# EAGLE schematic mainboard (EAGLE 6.4)
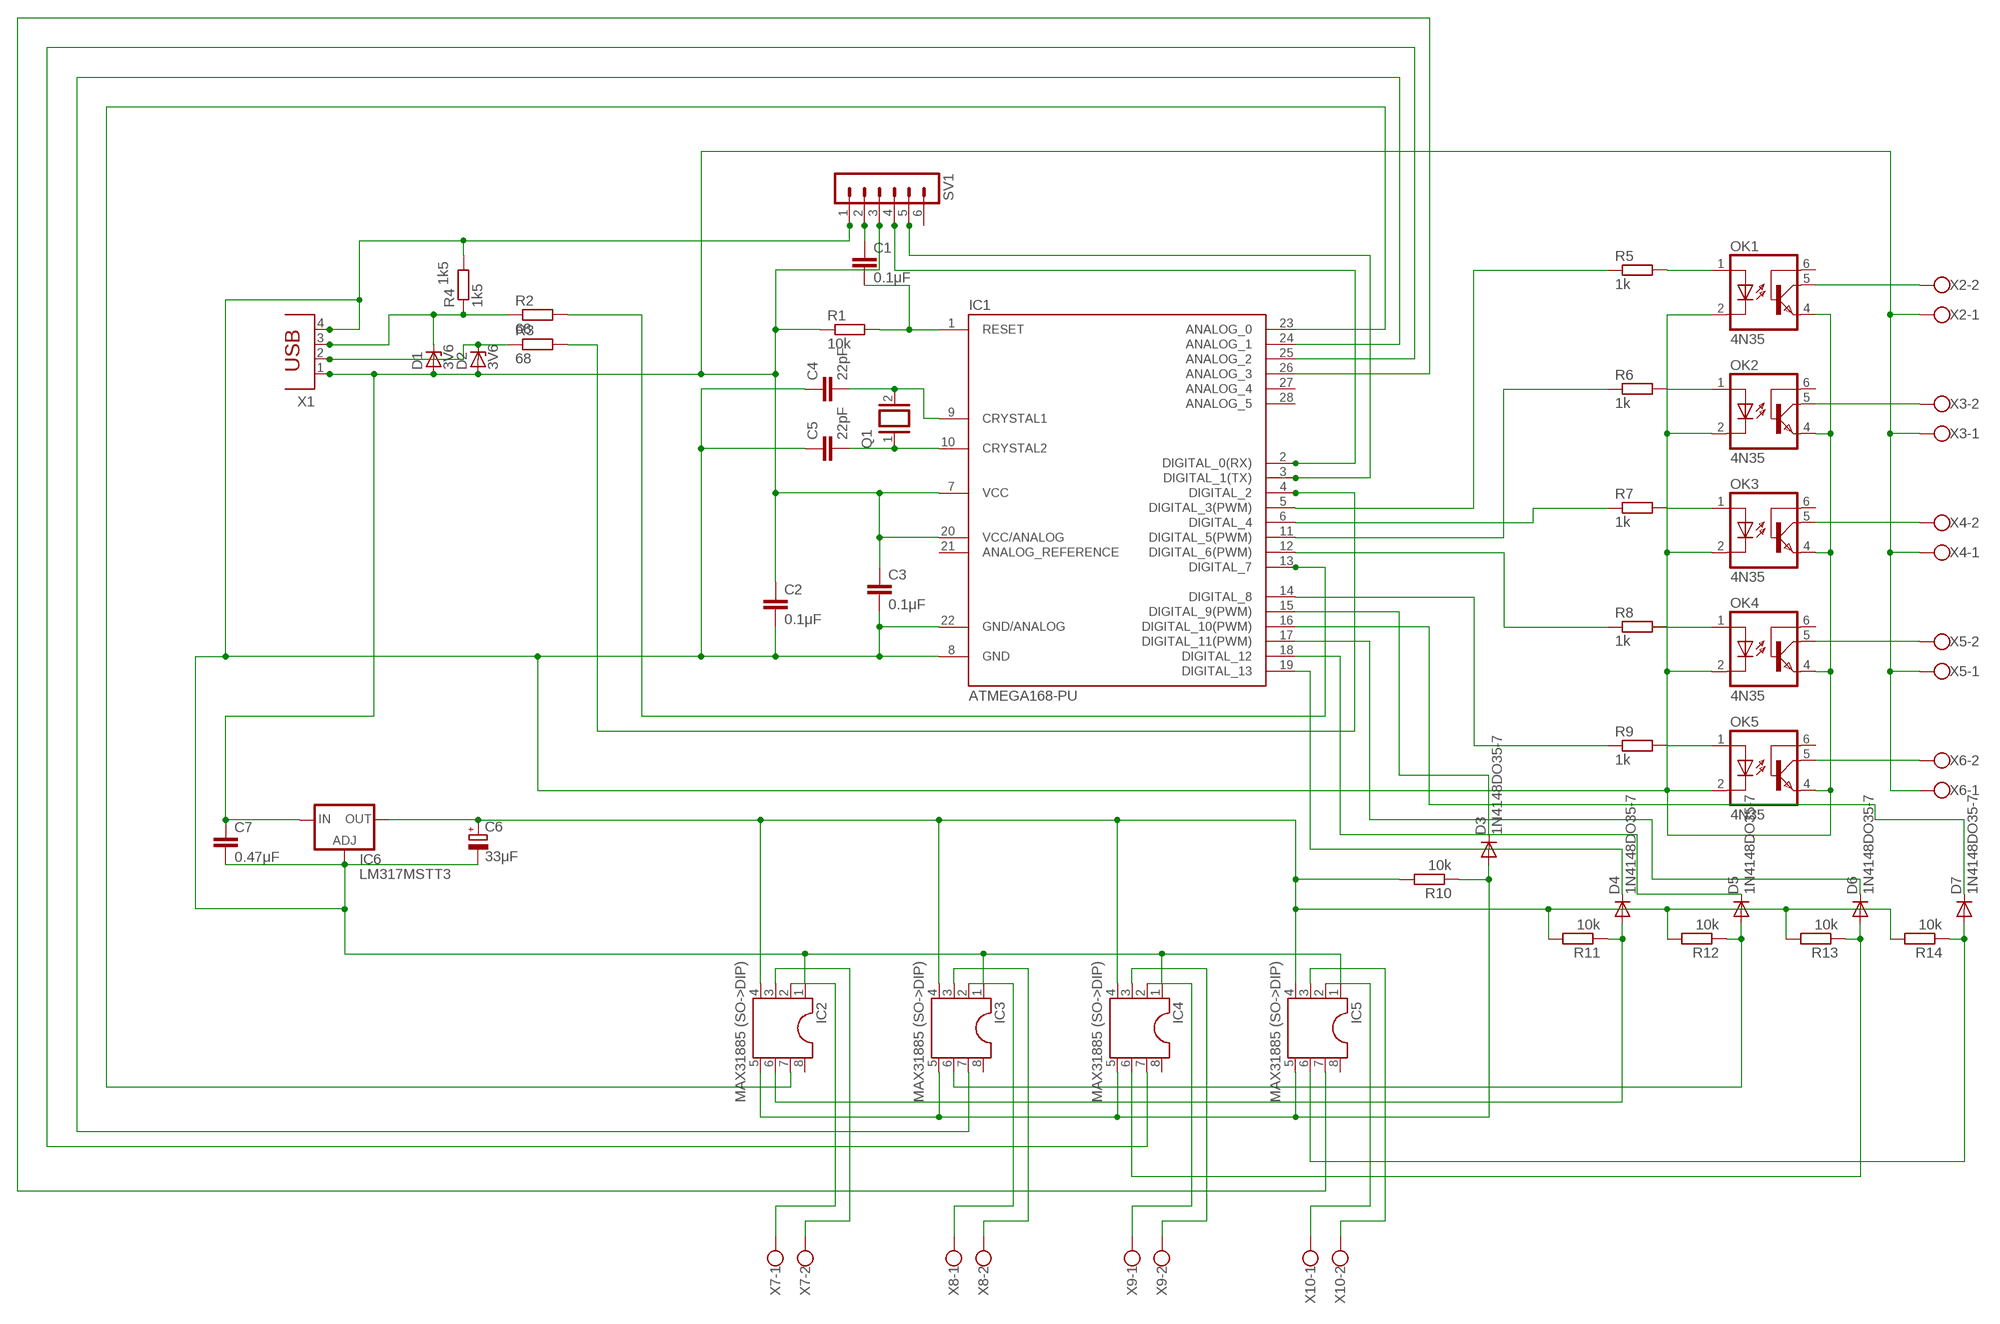
[diagram p0: schematic, sheet 1]

## Parts
C1  0.1μF  C2,5-3  [C2.5-3]
C2  0.1μF  C2,5-3  [C2.5-3]
C3  0.1μF  C2,5-3  [C2.5-3]
C4  22pF  C2,5-3  [C2.5-3]
C5  22pF  C2,5-3  [C2.5-3]
C6  33μF  CPOL-EU153CLV-0605  [153CLV-0605]
C7  0.47μF  C2,5-3  [C2.5-3]
D1  3V6  ZENER-DIODEZD-5  [ZDIO-5]
D2  3V6  ZENER-DIODEZD-5  [ZDIO-5]
D3  1N4148DO35-7  [DO35-7]
D4  1N4148DO35-7  [DO35-7]
D5  1N4148DO35-7  [DO35-7]
D6  1N4148DO35-7  [DO35-7]
D7  1N4148DO35-7  [DO35-7]
IC1  ATMEGA168-PU  [DIL28-3]
IC2  DIL8S  [SOCKET-08]
IC3  DIL8S  [SOCKET-08]
IC4  DIL8S  [SOCKET-08]
IC5  DIL8S  [SOCKET-08]
IC6  LM317MSTT3  [SOT223]
OK1  4N35  [DIL06]
OK2  4N35  [DIL06]
OK3  4N35  [DIL06]
OK4  4N35  [DIL06]
OK5  4N35  [DIL06]
Q1  XTAL/S  [QS]
R1  10k  R-EU_0204/7  [0204/7]
R2  68  R-EU_0204/7  [0204/7]
R3  68  R-EU_0204/7  [0204/7]
R4  1k5  R-EU_0204/7  [0204/7]
R5  1k  R-EU_0204/7  [0204/7]
R6  1k  R-EU_0204/7  [0204/7]
R7  1k  R-EU_0204/7  [0204/7]
R8  1k  R-EU_0204/7  [0204/7]
R9  1k  R-EU_0204/7  [0204/7]
R10  10k  R-EU_0204/7  [0204/7]
R11  10k  R-EU_0204/7  [0204/7]
R12  10k  R-EU_0204/7  [0204/7]
R13  10k  R-EU_0204/7  [0204/7]
R14  10k  R-EU_0204/7  [0204/7]
SV1  MA06-1  [MA06-1]
X1  PN61729  [PN61729]
X2  W237-102  [W237-102]
X3  W237-102  [W237-102]
X4  W237-102  [W237-102]
X5  W237-102  [W237-102]
X6  W237-102  [W237-102]
X7  W237-102  [W237-102]
X8  W237-102  [W237-102]
X9  W237-102  [W237-102]
X10  W237-102  [W237-102]

## Nets
N$1: C1.2 IC1.1(RESET) R1.2
N$2: D1.C R2.1 R4.1 X1.3
N$3: C2.1 C3.1 C7.1 D1.A D2.A IC1.7(VCC) IC1.20(VCC/ANALOG) IC6.3(IN) R1.1 SV1.3 X1.1 X2.1 X3.1 X4.1 X5.1 X6.1
N$4: C1.1 SV1.2
N$5: D2.C R3.1 X1.2
N$6: IC1.2(DIGITAL_0(RX)) SV1.4
N$7: IC1.3(DIGITAL_1(TX)) SV1.5
N$8: C4.2 IC1.9(CRYSTAL1) Q1.2
N$9: IC2.3 X7.2
N$10: IC1.4(DIGITAL_2) R3.2
N$11: IC1.13(DIGITAL_7) R2.2
N$12: C5.2 IC1.10(CRYSTAL2) Q1.1
N$13: IC1.5(DIGITAL_3(PWM)) R5.1
N$14: IC1.11(DIGITAL_5(PWM)) R6.1
N$15: IC1.6(DIGITAL_4) R7.1
N$16: IC1.12(DIGITAL_6(PWM)) R8.1
N$17: IC1.14(DIGITAL_8) R9.1
N$18: OK1.1(A) R5.2
N$19: OK2.1(A) R6.2
N$20: OK3.1(A) R7.2
N$21: OK4.1(A) R8.2
N$22: OK5.1(A) R9.2
N$23: OK5.5(COL) X6.2
N$24: OK4.5(COL) X5.2
N$25: OK3.5(COL) X4.2
N$26: OK2.5(COL) X3.2
N$27: OK1.5(COL) X2.2
N$28: IC2.2 X7.1
N$29: C2.2 C3.2 C4.1 C5.1 C6.- C7.2 IC1.8(GND) IC1.22(GND/ANALOG) IC2.1 IC3.1 IC4.1 IC5.1 IC6.1(ADJ) OK1.2(C) OK1.4(EMI) OK2.2(C) OK2.4(EMI) OK3.2(C) OK3.4(EMI) OK4.2(C) OK4.4(EMI) OK5.2(C) OK5.4(EMI) R4.2 SV1.1 X1.4
N$30: C6.+ IC2.4 IC3.4 IC4.4 IC5.4 IC6.4(OUT) R10.2 R11.2 R12.2 R13.2 R14.2
N$31: IC3.3 X8.2
N$32: IC4.3 X9.2
N$33: IC5.3 X10.2
N$34: IC3.2 X8.1
N$35: IC4.2 X9.1
N$36: IC5.2 X10.1
N$37: D3.A IC2.5 IC3.5 IC4.5 IC5.5 R10.1
N$38: D3.C IC1.15(DIGITAL_9(PWM))
N$39: D5.A IC3.6 R12.1
N$40: D4.A IC2.6 R11.1
N$41: D6.A IC4.6 R13.1
N$42: D7.A IC5.6 R14.1
N$43: D4.C IC1.19(DIGITAL_13)
N$44: D5.C IC1.18(DIGITAL_12)
N$45: D6.C IC1.17(DIGITAL_11(PWM))
N$46: D7.C IC1.16(DIGITAL_10(PWM))
N$47: IC1.23(ANALOG_0) IC2.7
N$48: IC1.24(ANALOG_1) IC3.7
N$49: IC1.25(ANALOG_2) IC4.7
N$50: IC1.26(ANALOG_3) IC5.7
Unconnected: IC1.21(ANALOG_REFERENCE) IC1.27(ANALOG_4) IC1.28(ANALOG_5) IC2.8 IC3.8 IC4.8 IC5.8 OK1.6(BAS) OK2.6(BAS) OK3.6(BAS) OK4.6(BAS) OK5.6(BAS) SV1.6

## Notes on the sheet
- 1k5
- MAX31885 (SO->DIP) | MAX31885 (SO->DIP) | MAX31885 (SO->DIP) | MAX31885 (SO->DIP)

## Library data of the parts
C1-C5 C7 = capacitor-wima:C: CAPACITOR naming: grid - package width
C6 = resistor:CPOL-EU: POLARIZED CAPACITOR, European symbol
D1 D2 = diode:ZENER-DIODE: Z-Diode
D3-D7 = diode:1N4148: DIODE high speed (Philips)
IC1 = Arduino-AVR:ATMEGA168-PU
IC2-IC5 = ic-package:DIL8: Dual In Line / Socket
IC6 = v-reg-mod:LM317?*: 500 mA Adjustable Output Positive Voltage Regulator Source: http://www.onsemi.co.jp .. LM317M-D.PDF
OK1-OK5 = optocoupler:4N35: MOTOROLA OPTO COUPLER; MF: FAIRCHILD SEMICONDUCTOR; MPN: 4N35; OC_FARNELL: 1328375; OC_NEWARK: 72K9946
Q1 = special:XTAL/S: CRYSTAL
R1-R14 = resistor:R-EU_: RESISTOR, European symbol
SV1 = con-lstb:MA06-1: PIN HEADER; OC_FARNELL: unknown; OC_NEWARK: unknown
X1 = con-berg:PN61729: BERG USB connector; OC_FARNELL: unknown; OC_NEWARK: unknown
X2-X10 = con-wago-500:W237-102: WAGO SCREW CLAMP; MPN: 237-102; OC_FARNELL: unknown; OC_NEWARK: 70K9898